# Altium schematic sheet SD.SchDoc
size A; SheetNumber: 10
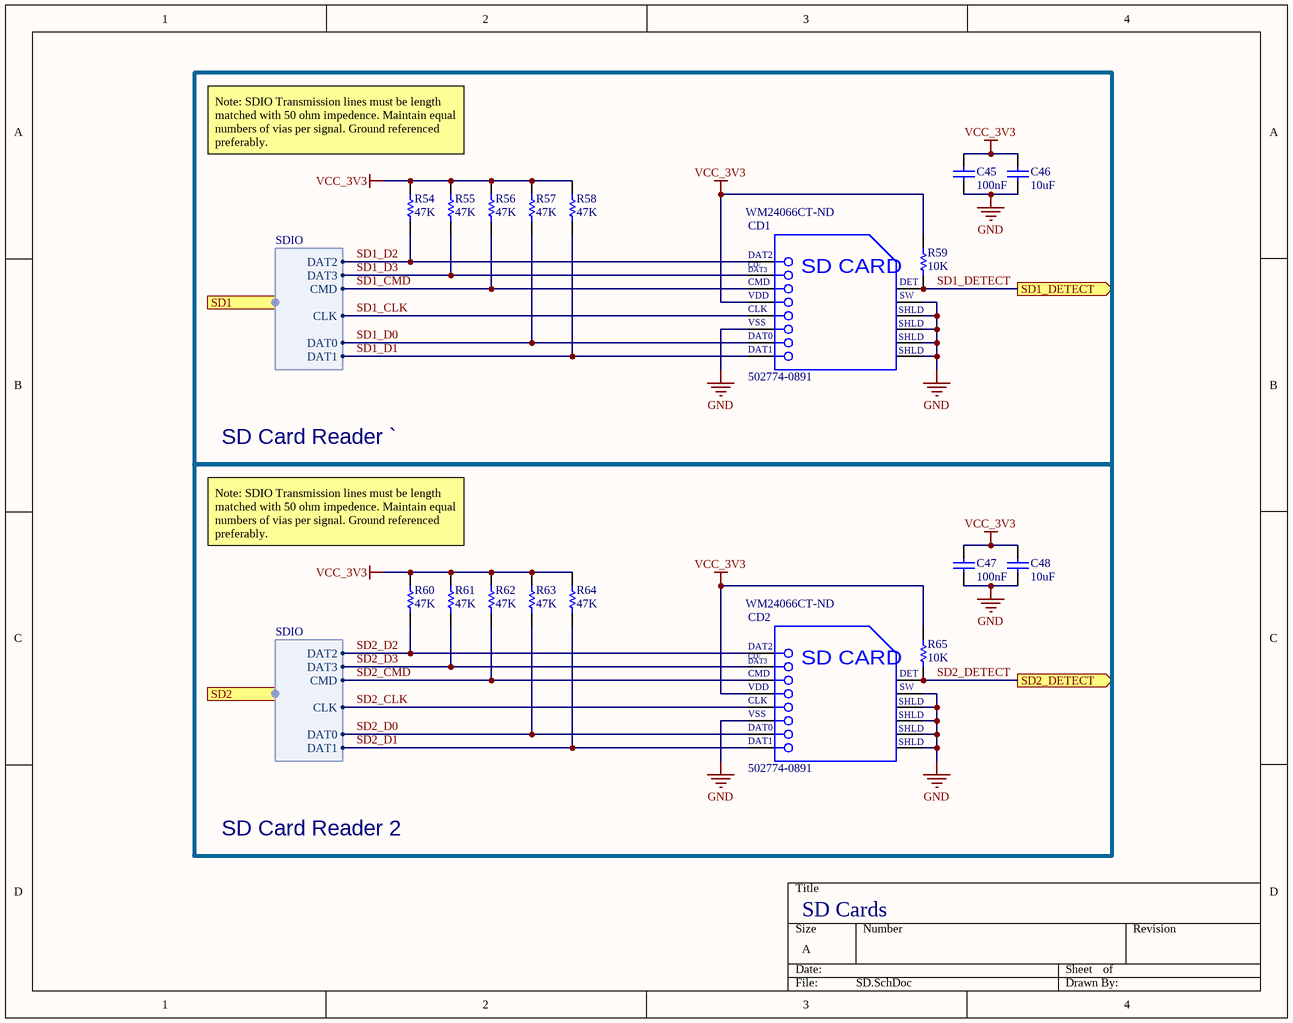
[diagram p0: SD.SchDoc]

## Parts
C45  100nF  [CAPC0603(1608)100_N]
C46  10uF  [CAPC0603(1608)100_N]
C47  100nF  [CAPC0603(1608)100_N]
C48  10uF  [CAPC0603(1608)100_N]
CD1  502774-0891  Supplier Part Number 1: WM24066CT-ND  [MOLX-502774-0891_V]
CD2  502774-0891  Supplier Part Number 1: WM24066CT-ND  [MOLX-502774-0891_V]
R54  47K  [RESC0603(1608)_N]
R55  47K  [RESC0603(1608)_N]
R56  47K  [RESC0603(1608)_N]
R57  47K  [RESC0603(1608)_N]
R58  47K  [RESC0603(1608)_N]
R59  10K  [RESC0603(1608)_N]
R60  47K  [RESC0603(1608)_N]
R61  47K  [RESC0603(1608)_N]
R62  47K  [RESC0603(1608)_N]
R63  47K  [RESC0603(1608)_N]
R64  47K  [RESC0603(1608)_N]
R65  10K  [RESC0603(1608)_N]

## Blocks framed on the sheet
SD Card Reader `: C45 C46 CD1 R54-R59
SD Card Reader 2: C47 C48 CD2 R60-R65

## Ports
SD1 (harness SDIO), SD1_DETECT (out), SD2 (harness SDIO), SD2_DETECT (out)

## Harnesses
SDIO: DAT0, DAT1, DAT2, DAT3, CMD, CLK

## Nets
GND: C45.1 C46.1 C47.1 C48.1 CD1.6(VSS) CD1.10(SWITCH) CD1.11(SHLD) CD1.12(SHLD) CD1.13(SHLD) CD1.14(SHLD) CD2.6(VSS) CD2.10(SWITCH) CD2.11(SHLD) CD2.12(SHLD) CD2.13(SHLD) CD2.14(SHLD)
VCC_3V3: C45.2 C46.2 C47.2 C48.2 CD1.4(VDD) CD2.4(VDD) R54.2 R55.2 R56.2 R57.2 R58.2 R59.2 R60.2 R61.2 R62.2 R63.2 R64.2 R65.2
SD1_CLK: CD1.5(CLK) ; port SD1.CLK
SD1_CMD: CD1.3(CMD) R56.1 ; port SD1.CMD
SD1_D0: CD1.7(DAT0) R57.1 ; port SD1.DAT0
SD1_D1: CD1.8(DAT1) R58.1 ; port SD1.DAT1
SD1_D2: CD1.1(DAT2) R54.1 ; port SD1.DAT2
SD1_D3: CD1.2(CD/DAT3) R55.1 ; port SD1.DAT3
SD1_DETECT: CD1.9(DETECT) R59.1 ; port SD1_DETECT
SD2_CLK: CD2.5(CLK) ; port SD2.CLK
SD2_CMD: CD2.3(CMD) R62.1 ; port SD2.CMD
SD2_D0: CD2.7(DAT0) R63.1 ; port SD2.DAT0
SD2_D1: CD2.8(DAT1) R64.1 ; port SD2.DAT1
SD2_D2: CD2.1(DAT2) R60.1 ; port SD2.DAT2
SD2_D3: CD2.2(CD/DAT3) R61.1 ; port SD2.DAT3
SD2_DETECT: CD2.9(DETECT) R65.1 ; port SD2_DETECT

## Notes on the sheet
- Note: SDIO Transmission lines must be length matched with 50 ohm impedence. Maintain equal numbers of vias per signal. Ground referenced preferably.
- SD Cards
- (in symbol CMP-2000-05248-1) CD/; DAT3; SD CARD; DET; SW

## Library data of the parts
C45 C47 = CMP-1035-02580-1: CAP 100nF 10V ±10% 0603 (1608 Metric) Thickness 1mm SMD; Tolerance: Â±10%; Case-EIA: 0603; Case-Metric: 1608; Max Thickness: 1 mm; Value: 100nF; Rated Voltage: 10 V; Technology: SMT
C46 C48 = CMP-1035-02799-1: CAP 10uF 10V ±10% 0603 (1608 Metric) Thickness 1mm SMD; Tolerance: Â±10%; Case-Metric: 1608; Case-EIA: 0603; Max Thickness: 1 mm; Technology: SMT; Rated Voltage: 10 V; Value: 10uF
CD1 CD2 = CMP-2000-05248-1: Micro SD Memory Card Connector, 0.5 A, 10 V (DC), -25 to 85 degC, 8-Pin SMT, RoHS, Tape and Reel; Manufacturer: Molex; 3D Model: 502774-0891.stp; Online Catalog: microSD™Series; Number of Positions: 10(8+2); Card Type: SecureDigital-microSD™; Insertion, Removal Method: PushIn,PushOut; Other Names: WM24066DKR; Connector Type: ConnectorandEjector; Gender: Male; Max Voltage Rating (DC): 1.01kV; Current Rating: 500mA; Voltage Rating (AC): 10V; Number of Contacts: 8; Pitch: 1.1mm; Features: Switch; Family: MemoryConnectors-PCCardSockets; Manufacturer URL: http://www.molex.com/; Mounting Type: SurfaceMount,RightAngle; Contact Finish Thickness: 20µin(0.51µm); Standard Package: 1; Series: 502774; Ejector Side: -; Datasheet Version: Rev. D, 04/2004; Category: Connectors,Interconnects; Contact Finish: Gold; Datasheet URL: https://datasheet.ciiva.com/1104/1499551-1104671.pdf; RoHS Information: 502774-0891CertofCompliance; Mounting Feature: Reverse-Bottom; Packaging: Digi-Reel; Height Above Board: 0.071"(1.80mm); Catalog Drawings: 502774-0891; Supplier 1: Digi-Key; Manufacturer Part Number: 502774-0891; Stock 1: 7772; Pricing 1: 1=3.31, 10=3.177, 25=2.912, 50=2.7796, 100=2.6473, 250=2.3164, 500=2.2502 (USD); Mount: Surface Mount,Reverse; Contact Material: Copper,Copper Alloy; Contact Plating: Gold; Housing Material: Polymer; Min Operating Temperature: -25°C; Max Operating Temperature: 85°C; Number of Rows: 1; Package Quantity: 1; Termination: Solder; Orientation: Right Angle; Number of Circuits: 8; Length: 14.6mm; Height: 1.8mm; Width: 1.8mm; Depth: 16mm; Radiation Hardening: No; REACH SVHC: Unknown; Halogen Free: Low Halogen; ComponentLink1URL: https://datasheet.ciiva.com/15226/getdatasheetpartid-119109-15226226.pdf; ComponentLink1Description: https://datasheet.ciiva.com/15226/getdatasheetpartid-119109-15226226.pdf; ComponentLink2URL: https://datasheet.ciiva.com/16655/5027740891-memory-card-socket-16655603.pdf; ComponentLink2Description: https://datasheet.ciiva.com/16655/5027740891-memory-card-socket-16655603.pdf; ComponentLink3URL: https://datasheet.ciiva.com/11755/0900766b80f752a0-11755064.pdf; ComponentLink3Description: https://datasheet.ciiva.com/11755/0900766b80f752a0-11755064.pdf; ComponentLink4URL: https://datasheet.ciiva.com/683/5027740891-sd-683628.pdf; ComponentLink4Description: https://datasheet.ciiva.com/683/5027740891-sd-683628.pdf; ComponentLink5URL: https://datasheet.ciiva.com/683/5027740891-sd-683629.pdf; ComponentLink5Description: https://datasheet.ciiva.com/683/5027740891-sd-683629.pdf; ComponentLink6URL: https://datasheet.ciiva.com/683/5027740891-sd-683630.pdf; ComponentLink6Description: https://datasheet.ciiva.com/683/5027740891-sd-683630.pdf; ComponentLink7URL: https://datasheet.ciiva.com/1104/ps-502774-001-1104670.pdf; ComponentLink7Description: https://datasheet.ciiva.com/1104/ps-502774-001-1104670.pdf; ComponentLink8URL: https://datasheet.ciiva.com/4581/5027740891-memory-card-socket-179575-4581102.pdf; ComponentLink8Description: https://datasheet.ciiva.com/4581/5027740891-memory-card-socket-179575-4581102.pdf; ComponentLink9URL: https://datasheet.ciiva.com/1104/1499551-1104671.pdf; ComponentLink9Description: https://datasheet.ciiva.com/1104/1499551-1104671.pdf
R54-R58 R60-R64 = CMP-1012-00699-1: 47K 0.1W 1% 0603 (1608 Metric)  SMD; Case-Metric: 1608; Case-EIA: 0603; Value: 47000.00 Ohm; Technology: SMT; Power: 0.1 W; Tolerance: 1 %
R59 R65 = CMP-1012-00098-1: 10K 0.1W 5% 0603 (1608 Metric)  SMD; Case-EIA: 0603; Value: 10000.00 Ohm; Case-Metric: 1608; Technology: SMT; Tolerance: 5 %; Power: 0.1 W